# Altium schematic sheet dev-board.SchDoc
size A4; SheetNumber: 1; SheetTotal: 2
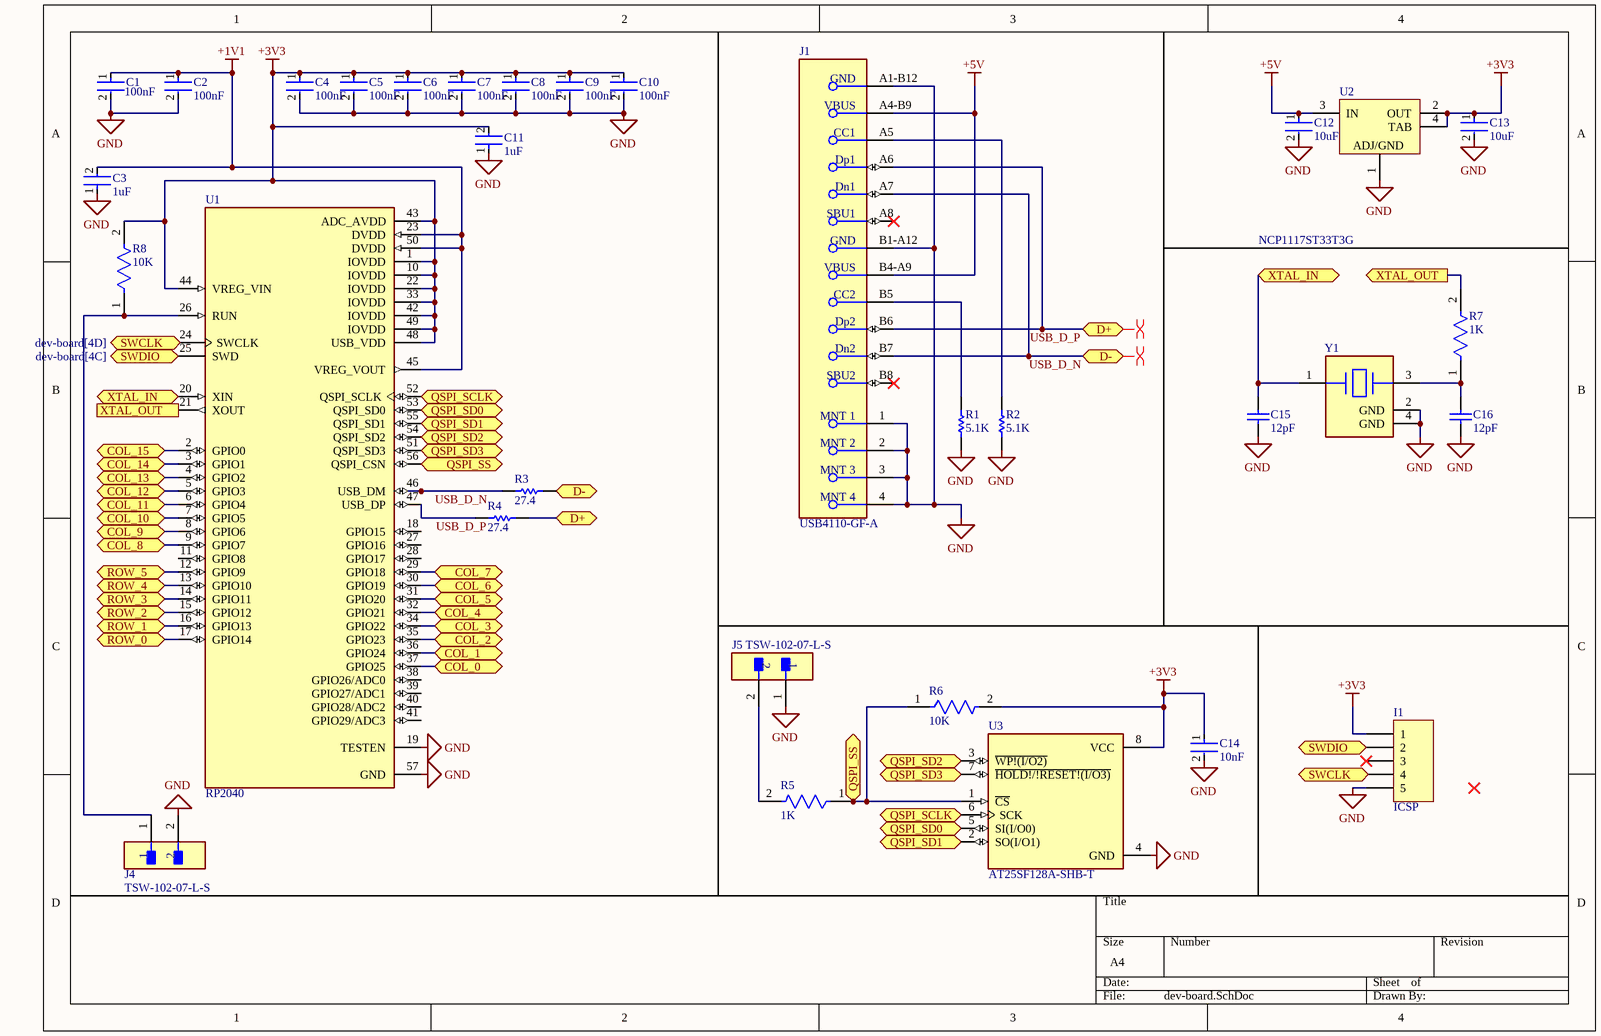
[diagram p0: dev-board.SchDoc]

## Parts
C1  100nF  [FP-CC0603-DA-MFG]
C2  100nF  [FP-CC0603-DA-MFG]
C3  1uF  [FP-CC0603-DA-MFG]
C4  100nF  [FP-CC0603-DA-MFG]
C5  100nF  [FP-CC0603-DA-MFG]
C6  100nF  [FP-CC0603-DA-MFG]
C7  100nF  [FP-CC0603-DA-MFG]
C8  100nF  [FP-CC0603-DA-MFG]
C9  100nF  [FP-CC0603-DA-MFG]
C10  100nF  [FP-CC0603-DA-MFG]
C11  1uF  [FP-CC0603-DA-MFG]
C12  10uF  [FP-CC0603-0_15-0_95-MFG]
C13  10uF  [FP-CC0603-0_15-0_95-MFG]
C14  10nF  [FP-CC0603-DA-MFG]
C15  12pF  [CAPC1608X90X40NL10T20]
C16  12pF  [CAPC1608X90X40NL10T20]
I1  ICSP  [TC2030-MCP-NL]
J1  USB4110-GF-A  [FP-USB4110-GF-A-MFG]
J4  TSW-102-07-L-S  [FP-TSW-102-07-L-S-MFG]
J5  TSW-102-07-L-S  [FP-TSW-102-07-L-S-MFG]
R1  5.1K  [RESC1608X55X25LL10T15]
R2  5.1K  [RESC1608X55X25LL10T15]
R3  27.4  [RESC1608X55X25LL10T15]
R4  27.4  [RESC1608X55X25LL10T15]
R5  1K  [FP-RC0603-0_55-MFG]
R6  10K  [FP-RC0603-0_55-MFG]
R7  1K  [FP-RC0603-0_55-MFG]
R8  10K  [FP-RC0603-0_55-MFG]
U1  RP2040  [QFN40P700X700X90-57N]
U2  NCP1117ST33T3G  [ONSC-SOT-223-4-318H-01_A_V]
U3  AT25SF128A-SHB-T  [SOIC127P790X216-8N]
Y1  (no value)  [FP-ECX-33Q-MFG]

## Ports
COL_0 (bidir, see KeyMatrix[1A]), COL_1 (bidir, see KeyMatrix[2A]), COL_2 (bidir, see KeyMatrix[2A]), COL_3 (bidir, see KeyMatrix[3A]), COL_4 (bidir, see KeyMatrix[3A]), COL_5 (bidir, see KeyMatrix[4A]), COL_6 (bidir, see KeyMatrix[4A]), COL_7 (bidir, see KeyMatrix[5A]), COL_8 (bidir, see KeyMatrix[5A]), COL_9 (bidir, see KeyMatrix[6A]), COL_10 (bidir, see KeyMatrix[6A]), COL_11 (bidir, see KeyMatrix[6A]), COL_12 (bidir, see KeyMatrix[7A]), COL_13 (bidir, see KeyMatrix[7A]), COL_14 (bidir, see KeyMatrix[8A]), COL_15 (bidir, see KeyMatrix[8A]), D+ (bidir, see dev-board[2C]), D+ (bidir, see dev-board[3B]), D- (bidir, see dev-board[2B]), D- (bidir, see dev-board[3B]), QSPI_SCLK (bidir, see dev-board[1B]), QSPI_SCLK (bidir, see dev-board[3D]), QSPI_SD0 (bidir, see dev-board[1B]), QSPI_SD0 (bidir, see dev-board[3D]), QSPI_SD1 (bidir, see dev-board[1B]), QSPI_SD1 (bidir, see dev-board[3D]), QSPI_SD2 (bidir, see dev-board[1B]), QSPI_SD2 (bidir, see dev-board[3C]), QSPI_SD3 (bidir, see dev-board[1B]), QSPI_SD3 (bidir, see dev-board[3D]), QSPI_SS (bidir, see dev-board[1B]), QSPI_SS (bidir, see dev-board[3D]), ROW_0 (bidir, see KeyMatrix[1A]), ROW_1 (bidir, see KeyMatrix[1B]), ROW_2 (bidir, see KeyMatrix[1B]), ROW_3 (bidir, see KeyMatrix[1B]), ROW_4 (bidir, see KeyMatrix[1B]), ROW_5 (bidir, see KeyMatrix[1C]), SWCLK (bidir, see dev-board[1B]), SWCLK (bidir, see dev-board[4D]), SWDIO (bidir, see dev-board[1B]), SWDIO (bidir, see dev-board[4C]), XTAL_IN (bidir, see dev-board[1B]), XTAL_IN (bidir, see dev-board[4B]), XTAL_OUT (out, see dev-board[1B]), XTAL_OUT (out, see dev-board[4B])

## Nets
+1V1: C1.1 C2.1 C3.2 U1.23(DVDD) U1.45(VREG_VOUT) U1.50(DVDD)
+3V3: C4.1 C5.1 C6.1 C7.1 C8.1 C9.1 C10.1 C11.2 C13.1 C14.1 I1.1 R6.2 R8.2 U1.1(IOVDD) U1.10(IOVDD) U1.22(IOVDD) U1.33(IOVDD) U1.42(IOVDD) U1.43(ADC_AVDD) U1.44(VREG_VIN) U1.48(USB_VDD) U1.49(IOVDD) U2.2(OUT) U2.4(TAB) U3.8(VCC)
+5V: C12.1 J1.A4-B9(VBUS) J1.B4-A9(VBUS) U2.3(IN)
GND: C1.2 C2.2 C3.1 C4.2 C5.2 C6.2 C7.2 C8.2 C9.2 C10.2 C11.1 C12.2 C13.2 C14.2 C15.1 C16.1 I1.5 J1.1(MNT_1) J1.2(MNT_2) J1.3(MNT_3) J1.4(MNT_4) J1.A1-B12(GND) J1.B1-A12(GND) J4.2 J5.1 R1.1 R2.1 U1.19(TESTEN) U1.57(GND) U2.1(ADJ/GND) U3.4(GND) Y1.2(GND) Y1.4(GND)
COL_0: U1.37(GPIO25) ; port COL_0
COL_1: U1.36(GPIO24) ; port COL_1
COL_2: U1.35(GPIO23) ; port COL_2
COL_3: U1.34(GPIO22) ; port COL_3
COL_4: U1.32(GPIO21) ; port COL_4
COL_5: U1.31(GPIO20) ; port COL_5
COL_6: U1.30(GPIO19) ; port COL_6
COL_7: U1.29(GPIO18) ; port COL_7
COL_8: U1.9(GPIO7) ; port COL_8
COL_9: U1.8(GPIO6) ; port COL_9
COL_10: U1.7(GPIO5) ; port COL_10
COL_11: U1.6(GPIO4) ; port COL_11
COL_12: U1.5(GPIO3) ; port COL_12
COL_13: U1.4(GPIO2) ; port COL_13
COL_14: U1.3(GPIO1) ; port COL_14
COL_15: U1.2(GPIO0) ; port COL_15
QSPI_SCLK: U1.52(QSPI_SCLK) U3.6(SCK) ; port QSPI_SCLK
QSPI_SD0: U1.53(QSPI_SD0) U3.5(SI(I/O0)) ; port QSPI_SD0
QSPI_SD1: U1.55(QSPI_SD1) U3.2(SO(I/O1)) ; port QSPI_SD1
QSPI_SD2: U1.54(QSPI_SD2) U3.3(~{WP!(I/O2)}) ; port QSPI_SD2
QSPI_SD3: U1.51(QSPI_SD3) U3.7(~{HOLD!/!RESET!(I/O3)}) ; port QSPI_SD3
QSPI_SS: R5.1 R6.1 U1.56(QSPI_CSN) U3.1(~{CS}) ; port QSPI_SS
ROW_0: U1.17(GPIO14) ; port ROW_0
ROW_1: U1.16(GPIO13) ; port ROW_1
ROW_2: U1.15(GPIO12) ; port ROW_2
ROW_3: U1.14(GPIO11) ; port ROW_3
ROW_4: U1.13(GPIO10) ; port ROW_4
ROW_5: U1.12(GPIO9) ; port ROW_5
SWDIO: I1.2 U1.25(SWD) ; port SWDIO
USB_D_N: J1.A7(Dn1) J1.B7(Dn2) R3.1 R3.2 U1.46(USB_DM) ; port D-
USB_D_P: J1.A6(Dp1) J1.B6(Dp2) R4.1 R4.2 U1.47(USB_DP) ; port D+
XTAL_IN: C15.2 U1.20(XIN) Y1.1(In/Out) ; port XTAL_IN
XTAL_OUT: R7.2 U1.21(XOUT) ; port XTAL_OUT
NetC16_2: C16.2 R7.1 Y1.3(Out/In)
NetJ1_A5: J1.A5(CC1) R2.2
NetJ1_B5: J1.B5(CC2) R1.2
NetJ4_1: J4.1 R8.1 U1.26(RUN)
NetJ5_2: J5.2 R5.2

Not connected (* = marked no-connect by the designer): I1 3* 4; J1 A8(SBU1)* B8(SBU2)*; U1 11(GPIO8) 18(GPIO15) 24(SWCLK) 27(GPIO16) 28(GPIO17) 38(GPIO26/ADC0) 39(GPIO27/ADC1) 40(GPIO28/ADC2) 41(GPIO29/ADC3)

## Layout directives
differential pair: USB_D_N, USB_D_P

## Library data of the parts
C1 C2 C4-C10 = CMP-03422-001490-1: CAP CER 0.1UF 50V X7R 0603; Tolerance: 5%; Number of Pins: 2; Depth: 0.8mm; Weight: 7.1E-05oz; Radiation Hardening: No; Capacitance: 100nF; Case Code (Metric): 1608; Dielectric: X7R; Max Operating Temperature: 125°C; Voltage Rating (DC): 50V; Case/Package: 0603; Halogen Free: Halogen Free; Mount: Surface Mount; Lead Free: Lead Free; Termination: SMD/SMT; RoHS Compliant: Yes; Length: 1.6mm; Series: CC; Resistor Type: Ceramic; Case Code (Imperial): 0603; Construction: Flat; Width: 0.031inch; Height: 0.8mm; Voltage Rating: 50V; Min Operating Temperature: -55°C; Thickness: 0.035inch; Packaging: Tape and Reel
C3 C11 = CMP-1035-02737-2: CAP CER 1UF 16V X5R 0603; Manufacturer Part Number: CC0603KRX5R7BB105; Manufacturer: YAGEO; Material: Ceramic; Temperature Coefficient: 15%; Tolerance: 0.1; Digikey Description: CAP CER 1UF 16V X5R 0603; Category: Cap; Automotive: No; Octopart: https://octopart.com/cc0603krx5r7bb105-yageo-8376530; Voltage Rating: 16 V; Device Class L3: Ceramic Capacitors; Value: 1 uF; Temperature Characteristic: X5R; Voltage: 16 V; RoHS: TRUE; Lead Free: Yes; Temperature: -55°C to +125°C; Device Class L2: Capacitors; ComponentLink2URL: http://www.yageo.com/documents/recent/UPY-GPHC_X7R_6.3V-to-50V_18.pdf; Capacitance: 1 uF; Footprint Url: http://www.yageo.com/exep/pages/download/literatures/UPY-C_GEN_24.pdf; Height: 0.9mm; ComponentLink2Description: Datasheet; Temperature Range High: +125°C; Mouser Description: Multilayer Ceramic Capacitors MLCC - SMD/SMT 1.0uF 16V X5R 10%; Package: CC0603-DA; Device Class L1: Passive Components; Temperature Range Low: -55°C
C12 C13 = CMP-03422-001506-1: CAP CER 10UF 6.3V X5R 0603; Tolerance: 20%; Voltage: 4V; Depth: 0.8mm; Halogen Free: Halogen Free; Case Code (Metric): 1608; Height: 0.8mm; Voltage Rating (DC): 6.3V; Construction: Flat; Series: CC; Lead Free: Lead Free; Min Operating Temperature: -55°C; Capacitance: 10uF; Thickness: 0.035inch; Max Operating Temperature: 85°C; Termination: SMD/SMT; Length: 1.6mm; Resistor Type: Ceramic; Dielectric: X5R; Mount: Surface Mount; Width: 0.031inch; Case/Package: 0603; Packaging: Tape and Reel; Case Code (Imperial): 0603; Voltage Rating: 6.3V; Weight: 7.1E-05oz; Radiation Hardening: No; RoHS Compliant: Yes
C14 = CMP-2100-03600-2: CAP CER 10000PF 50V X7R 0603; Manufacturer Part Number: CC0603KRX7R9BB103; Manufacturer: YAGEO; Tolerance: 0.1; Material: Ceramic; Temperature Coefficient: 15%; Mouser Description: Multilayer Ceramic Capacitor, CC Series, 0.01 - F, - 10%, X7R, 50 V, 0603 [1608 Metric]; Digikey Description: CAP CER 10000PF 50V X7R 0603; Height: 0.9mm; Category: Cap; Temperature Characteristic: X7R; Footprint Url: http://www.yageo.com/exep/pages/download/literatures/UPY-C_GEN_24.pdf; Lead Free: Yes; Voltage Rating: 50 V; Temperature: -55°C to +125°C; Device Class L3: Ceramic Capacitors; ComponentLink2Description: Datasheet; Voltage: 50 V; Package: CC0603-DA; Octopart: https://octopart.com/cc0603krx7r9bb103-yageo-192938; Automotive: No; Temperature Range High: +125°C; Temperature Range Low: -55°C; Value: 10 nF; RoHS: TRUE; Device Class L1: Passive Components; ComponentLink2URL: http://www.yageo.com/documents/recent/UPY-GPHC_X7R_6.3V-to-50V_18.pdf; Device Class L2: Capacitors; Capacitance: 10 nF
C15 C16 = CMP-1659-00031-1: Chip Capacitor, 12 pF, +/- 5%, 50 V, -55 to 125 degC, 0603 (1608 Metric), RoHS, Tape and Reel; Tolerance: 1%; Voltage Rating: 250 V; Case\Package: Axial; Power Rating: 250 mW; Resistance: 475 kohm; Mount: Through Hole; Length: 0.248 inch; PackageReference: 0603; DatasheetVersion: Rev. 14, 07/2016; Packaging: Bulk; Max Operating Temperature: 155 degC; Min Operating Temperature: -55 degC; ComponentLink2Description: Datasheet; ComponentLink2URL: http://www.yageo.com/NewPortal/yageodocoutput?fileName=/pdf/MLCC/UPY-GP_NP0_16V-to-50V_14.pdf; ComponentLink1URL: http://www.yageo.com/; PackageDescription: 2-Pin Surface Mount Device, Body 1.6 x 0.8 mm; Package Quantity: 200; RoHSCompliant: true; ComponentLink1Description: Manufacturer URL
J1 = CMP-245163-000002-1: CONN USB 2.0 TYPE-C R/A SMT; Manufacturer: GCT; Conn Orientation: Right Angle; Usb Standard: USB 2.0; Voltage Rating: 20V; Current Rating: 3/4.25/1.25/0.25A; Number Of Contacts: 16; Is Female: yes; Shielding: true; Standoff Height: 0.1mm; Octopart: https://octopart.com/usb4110-gf-a-gct-103941985; Temperature: -40°C to +85°C; RoHS: TRUE; Automotive: No; Contact Material: Gold,Nickel; Device Class L1: Connectors; Device Class L2: USB Connectors; Package: 0; Lead Free: Yes; ComponentLink2URL: https://gct.co/files/drawings/usb4110.pdf; Temperature Range High: +85°C; Temperature Range Low: -40°C; Height: 3.46mm; Manufacturer Part Number: USB4110-GF-A; ComponentLink2Description: Datasheet; Device Class L3: unset; Digikey Description: CONN USB 2.0 TYPE-C R/A SMT; Category: Conn
J4 J5 = CMP-02766-001428-1: CONN HEADER VERT 2POS 2.54MM; Voltage Rating: 550V; Current Rating: 7.6A; Gender: Male; Number of Contacts: 2; Connector Type: Male Pin; Radiation Hardening: No; Orientation: Straight; Contact Plating: Gold; Max Operating Temperature: 125°C; Mount: Through Hole; Package Quantity: 1; Number of Rows: 1; Housing Material: Polyester; RoHS Compliant: Yes; Length: 5.08mm; Max Voltage Rating (AC): 550V; Pitch: 2.54mm; Packaging: Bulk; Depth: 2.54mm; Termination: Solder; Min Operating Temperature: -55°C; Housing Color: Black; Lead Free: Lead Free; Color: Black; Number of Positions: 2; Width: 2.54mm; Max Current Rating: 7.6A; REACH SVHC: No SVHC; Contact Material: Bronze; Contact Mating Length: 0.23inch; Series: TSW; Contact Type: Male Pin
R1 R2 = CMP-2000-04091-1: Manufacturer: Yageo; Part Number: RC0603FR-075K1L
R3 R4 = CMP-2000-06933-1: Chip Resistor, 27 KOhm, +/- 1%, 0.1 W, -55 to 155 degC, 0603 (1608 Metric), RoHS, Tape and Reel; Manufacturer: Yageo; Resistance: 27kOhms; Temperature Coefficient: 100PPM/C; Power Rating: 100mW; Voltage Rating: 50V; Mounting Technology: SurfaceMount; Operating Temperature Range: -55Cto+155C; Case Code - in: 0603; Product: ThickFilmResistorsGeneralPurpose; Package Reference: 0603; Datasheet Version: Rev. 7, 05/2017; Tolerance: 1%; Manufacturer URL: http://www.yageo.com/; Termination Style: SMD/SMT; Packaging: Reel; Series: RC; Package Description: 2-Pin Surface Mount Device, Body 1.6 x 0.8 mm; Datasheet URL: http://www.yageo.com/documents/recent/PYu-RC_Group_51_RoHS_L_7.pdf; Case Code - mm: 1608
R5 R7 = CMP-1659-00009-5: RES 1K OHM 1% 1/10W 0603; Resistance: 1kR; Voltage Rating: 50V; Power Rating: 100mW; Temperature Coefficient: 100ppm/°C; Military Standard: Not; REACH SVHC: No SVHC; Size Code: 0603; Features: Moisture Resistant; Number of Terminations: 2; Technology: THICK FILM; Series: RC; Case Code (Metric): 1608; Resistance Tolerance: 1%; Resistor Type: Thick Film; Termination: SMD/SMT; Contact Plating: Tin; Radiation Hardening: No; Min Operating Temperature: -55°C; Max Operating Temperature: 155°C; Packaging: Tape and Reel; Max Power Dissipation: 100mW; RoHS Compliant: Yes; Height: 0.45mm; Lead Free: Lead Free; Case/Package: 0603; Length: 1.6mm; Tolerance: 1%; Case Code (Imperial): 0603; Construction: Rectangular; Depth: 0.8mm
R6 R8 = CMP-2100-03664-2: RES 10K OHM 1% 1/10W 0603; Voltage Rating: 75V; Voltage Rating (DC): 50V; Resistance: 10kR; Power Rating: 100mW; Temperature Coefficient: 100ppm/°C; Depth: 0.8mm; Termination: SMD/SMT; Resistor Type: Thick Film; Series: RC; Construction: Rectangular; Features: Moisture Resistant; Packaging: Tape and Reel; Min Operating Temperature: -55°C; Number of Terminations: 2; Lead Pitch: 0.3mm; RoHS Compliant: Yes; Case/Package: 0603; Resistance Tolerance: 1%; Military Standard: Not; Weight: 7.1E-05oz; Number of Pins: 2; Tolerance: 1%; Length: 1.6mm; Case Code (Imperial): 0603; Lead Free: Lead Free; Width: 0.8mm; Max Power Dissipation: 100mW; Height: 0.45mm; Max Operating Temperature: 155°C; Case Code (Metric): 1608; Size Code: 0603
U1 = RP2040: RP2040 chip for Raspberry Pi Pico - ARMÂ® CortexÂ®-M0+ MCU 32-Bit; SnapEDA_Link: https://www.snapeda.com/parts/RP2040/Raspberry+Pi/view-part/?ref=snap; Value: *; Purchase-URL: https://pricing.snapeda.com/search/part/RP2040/?ref=eda; MP: RP2040; Availability: In Stock; Check_prices: https://www.snapeda.com/parts/RP2040/Raspberry+Pi/view-part/?ref=eda; Package: None; MF: Raspberry Pi; Price: None
U2 = CMP-1679-00010-1: Low-Dropout Positive Fixed Voltage Regulator, 1 A, 3.3 V Output Voltage, 0 to 125 degC, 4-Pin SOT-223 (318H-01), Pb-Free, Tape and Reel; Resistance: 220 kohm; Type (Resistor): Thick Film; Voltage Rating: 75 V; Tolerance: 1%; Case\Package: 0603; Power Rating: 100 mW; Width: 0.85 mm; Weight: 7.1E-05 oz; ComponentLink2URL: http://www.onsemi.com/pub_link/Collateral/NCP1117-D.PDF; RoHSCompliant: true; Height: 0.45 mm; PackageDescription: 4-Pin Small Outline Transistor, Body 6.5 x 3.5 mm, Pitch 2.3 mm; ComponentLink1Description: Manufacturer URL; ComponentLink1URL: http://www.onsemi.com/; PackageReference: SOT-223-4-318H-01_A; Max Operating Temperature: 155 degC; Packaging: Tape and Reel; REACH SVHC: Unknown; Length: 1.55 mm; Package Quantity: 5000; Radiation Hardening: No; Min Operating Temperature: -55 degC; DatasheetVersion: Rev. 27, 09/2014; Mount: Surface Mount; Case Code (Imperial): 0603; Case Code (Metric): 1608; ComponentLink2Description: Datasheet
U3 = AT25SF128A-SHB-T: 128 Mbit Serial NOR Flash Memory with Dual and Quad I/O Support; MF: Dialog Semiconductor; Value: *; Purchase-URL: https://pricing.snapeda.com/search/part/AT25SF128A-SHB-T/?ref=eda; Package: SOIC-8 Dialog Semiconductor; MP: AT25SF128A-SHB-T; Check_prices: https://www.snapeda.com/parts/AT25SF128A-SHB-T/Dialog%20Semiconductor/view-part/5488499/?ref=eda; SnapEDA_Link: https://www.snapeda.com/parts/AT25SF128A-SHB-T/Dialog%20Semiconductor/view-part/5488499/?ref=snap; Price: None; Availability: Warning
Y1 = CMP-40224-000015-1: CRYSTAL 12.000MHZ 12PF SMD; Frequency: 12MHz; ESR (Equivalent Series Resistance): 100R; Frequency Tolerance: 20ppm; Frequency Stability: 50ppm; Ratings: AEC-Q200; Case/Package: SMD/SMT; Load Capacitance: 12pF; Packaging: Tape and Reel; Max Operating Temperature: 125°C; Width: 0.098inch; Min Operating Temperature: -40°C; Mount: Surface Mount; Length: 0.126inch; Height: 0.031inch